# Altium schematic sheet raw_input.SchDoc: Fault-Tolerant Quadcopter
size A; DrawnBy: Vaughn Kottler; Engineer: Vaughn Kottler; Revision: A
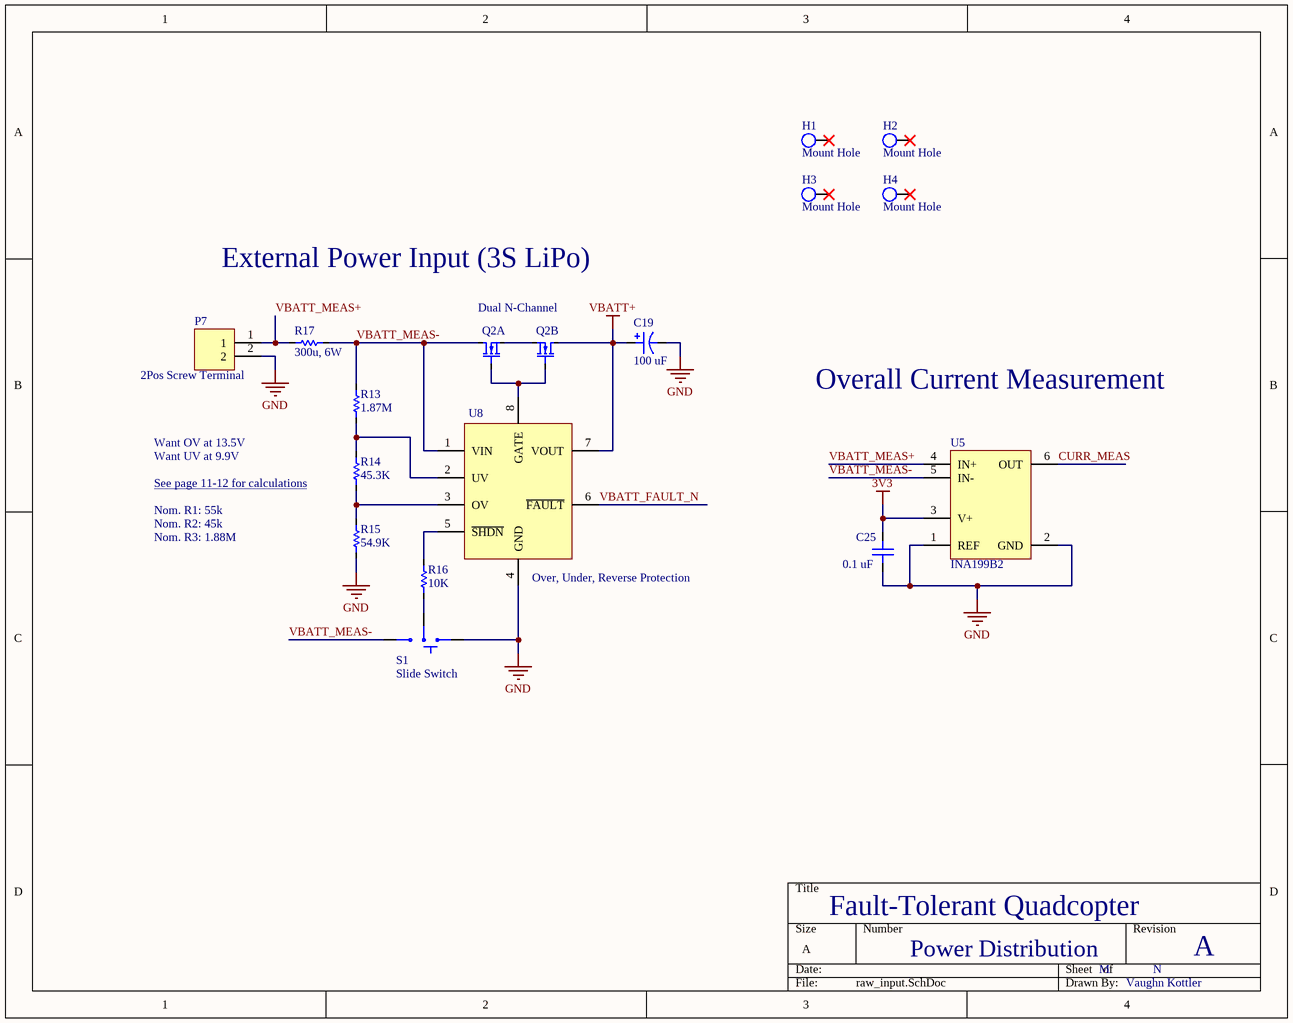
[diagram p0: raw_input.SchDoc]

## Parts
C19  100 uF  [CAP-CAN-8.3x8.3]
C25  0.1 uF  [CAP-CER-0805-SHORT]
H1  Mount Hole  [4mm Mount Hole]
H2  Mount Hole  [4mm Mount Hole]
H3  Mount Hole  [4mm Mount Hole]
H4  Mount Hole  [4mm Mount Hole]
P7  2Pos Screw Terminal  [2Pos Screw Terminal]
Q2  Dual N-Channel  [PowerPAK 8x8L]  (parts A,B of 2)
R13  1.87M  [RES-0805]
R14  45.3K  [RES-0805]
R15  54.9K  [RES-0805]
R16  10K  [RES-0805]
R17  300u, 6W  [RES-SHNT-2512]
S1  Slide Switch  [SMT Slide Switch RA]
U5  INA199B2  [SC70]
U8  Over, Under, Reverse Protection  [SOT-23-8]

## Nets
3V3: C25.2 U5.3(V+)
GND: C19.2 C25.1 P7.2 R15.1 S1.1(L) U5.1(REF) U5.2(GND) U8.4(GND)
VBATT+: C19.1 Q2.D2 U8.7(VOUT)
CURR_MEAS: U5.6(OUT)
VBATT_FAULT_N: U8.6(~{FAULT})
VBATT_MEAS+: P7.1 R17.1 U5.4(IN+)
VBATT_MEAS-: Q2.D1 R13.2 R17.2 S1.3(R) U5.5(IN-) U8.1(VIN)
NetQ2_G1: Q2.G1 Q2.G2 U8.8(GATE)
NetQ2_S1: Q2.S1 Q2.S2
NetR13_1: R13.1 R14.2 U8.2(UV)
NetR14_1: R14.1 R15.2 U8.3(OV)
NetR16_1: R16.1 S1.2(COM)
NetR16_2: R16.2 U8.5(~{SHDN})

Not connected (* = marked no-connect by the designer): H1 H*; H2 H*; H3 H*; H4 H*

## Notes on the sheet
- External Power Input (3S LiPo)
- Overall Current Measurement
- Want OV at 13.5V
- Want UV at 9.9V
- (near R14) See page 11-12 for calculations <https://www.analog.com/media/en/technical-documentation/data-sheets/4365fa.pdf>
- Nom. R1: 55k
- Nom. R2: 45k
- Nom. R3: 1.88M
- Power Distribution
- M
- N

## Library data of the parts
C19 = CAP-CAN-100uF-25V: ±20%, 8.3mm x 8.3mm; Supplier 1: Digi-Key; Supplier Part Number 1: PCE4003DKR-ND
C25 = CAP-CER-0.1uF-25V: 10%, 0805; ComponentLink1Description: Capacitor Book (Amazon); ComponentLink1URL: https://www.amazon.com/gp/product/B0728HBDRW/
P7 = 2Pos Screw Terminal: 0.2" Pitch 1x2
Q2 = SQJQ900E: Dual N-Channel 40V 100A; Supplier 1: Digi-Key; Supplier Part Number 1: SQJQ900E-T1_GE3DKR-ND; ComponentLink1Description: Datasheet; ComponentLink1URL: http://www.vishay.com/docs/62796/sqjq900e.pdf
R13 = RES-1.87M-1/8W: 1%, 0805; Supplier 1: Digi-Key; Supplier Part Number 1: P1.87BTDKR-ND
R14 = RES-45.3K-1/8W: 1%, 0805; Supplier 1: Digi-Key; Supplier Part Number 1: P45.3KCDKR-ND
R15 = RES-54.9K-1/8W: 1%, 0805; Supplier 1: Digi-Key; Supplier Part Number 1: 541-54.9KCDKR-ND
R16 = RES-10K-1/8W: 0805; ComponentLink1Description: Resistor Book (Amazon); ComponentLink1URL: https://www.amazon.com/gp/product/B071J21FYF/
R17 = RES-300u-6W: 2512, 1%; Supplier 1: Digi-Key; ComponentLink1Description: Datasheet; ComponentLink1URL: http://www.vishay.com/docs/30193/wslf.pdf; Supplier Part Number 1: 541-3123-6-ND
S1 = SMT Slide Switch: 2mm Pitch; Supplier 1: Digi-Key; Supplier Part Number 1: 360-2924-1-ND
U5 = INA199B2: 100 V/V, Current-Shunt Monitor; ComponentLink1Description: Datasheet; ComponentLink1URL: http://www.ti.com/lit/ds/symlink/ina199.pdf; Supplier 1: Digi-Key; Supplier Part Number 1: INA199B2DCKR-ND
U8 = LTC4365: Overvoltage, Undervoltage and Reverse Supply Protection Controller; Supplier 1: Digi-Key; Supplier Part Number 1: LTC4365CTS8#TRMPBFDKR-ND; ComponentLink1Description: Datasheet; ComponentLink1URL: https://www.analog.com/media/en/technical-documentation/data-sheets/4365fa.pdf